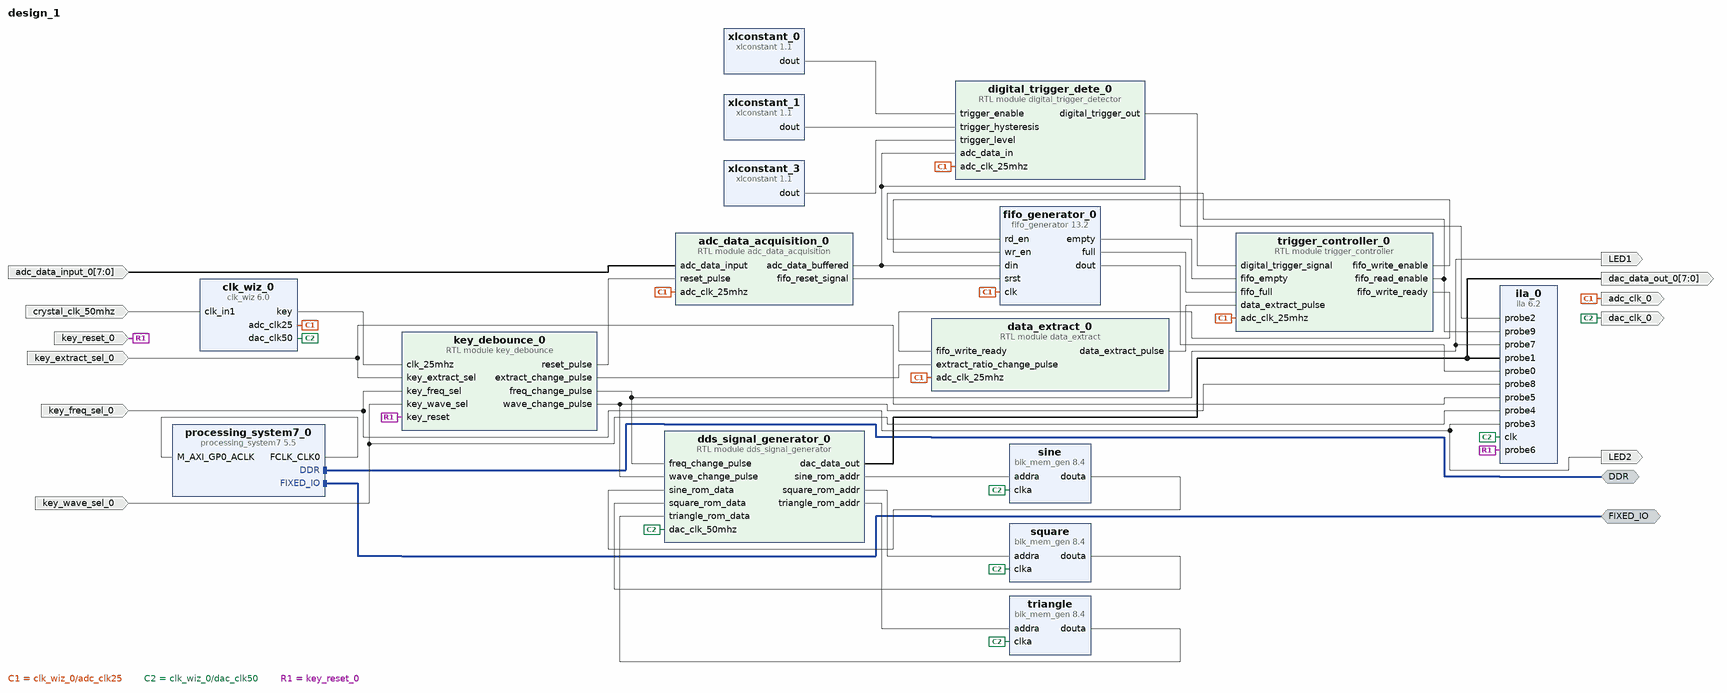
[diagram p0: block diagram of the top level]
# Vivado block design design_1, xc7z010clg400-1, Vivado 2025.1
create_bd_design design_1

create_bd_intf_port -mode Master -vlnv xilinx.com:interface:ddrx_rtl:1.0 DDR
create_bd_intf_port -mode Master -vlnv xilinx.com:display_processing_system7:fixedio_rtl:1.0 FIXED_IO
create_bd_port -dir I -type clk crystal_clk_50mhz
set_property -dict {CONFIG.FREQ_HZ 50000000} [get_bd_ports crystal_clk_50mhz]
create_bd_port -dir I key_freq_sel_0
create_bd_port -dir I key_wave_sel_0
create_bd_port -dir I key_extract_sel_0
create_bd_port -dir I -type rst key_reset_0
create_bd_port -dir O -from 7 -to 0 dac_data_out_0
create_bd_port -dir I -from 7 -to 0 adc_data_input_0
create_bd_port -dir O -type clk adc_clk_0
create_bd_port -dir O -type clk dac_clk_0
create_bd_port -dir O LED1
create_bd_port -dir O LED2

create_bd_cell -type ip -vlnv xilinx.com:ip:processing_system7:5.5 processing_system7_0
set_property -dict [list \
  CONFIG.PCW_ENET0_PERIPHERAL_ENABLE 0 \
  CONFIG.PCW_GPIO_MIO_GPIO_ENABLE 1 \
  CONFIG.PCW_GPIO_MIO_GPIO_IO MIO \
  CONFIG.PCW_I2C_RESET_ENABLE 1 \
  CONFIG.PCW_PRESET_BANK1_VOLTAGE {LVCMOS 1.8V} \
  CONFIG.PCW_QSPI_GRP_SINGLE_SS_ENABLE 1 \
  CONFIG.PCW_QSPI_GRP_SINGLE_SS_IO {MIO 1 .. 6} \
  CONFIG.PCW_QSPI_PERIPHERAL_ENABLE 1 \
  CONFIG.PCW_QSPI_QSPI_IO {MIO 1 .. 6} \
  CONFIG.PCW_SD0_GRP_CD_ENABLE 1 \
  CONFIG.PCW_SD0_GRP_CD_IO {MIO 47} \
  CONFIG.PCW_SD0_GRP_WP_ENABLE 0 \
  CONFIG.PCW_SD0_PERIPHERAL_ENABLE 1 \
  CONFIG.PCW_SD0_SD0_IO {MIO 40 .. 45} \
  CONFIG.PCW_SDIO_PERIPHERAL_FREQMHZ 100 \
  CONFIG.PCW_SINGLE_QSPI_DATA_MODE x4 \
  CONFIG.PCW_UART0_PERIPHERAL_ENABLE 1 \
  CONFIG.PCW_UART0_UART0_IO EMIO \
  CONFIG.PCW_UART1_GRP_FULL_ENABLE 1 \
  CONFIG.PCW_UART1_GRP_FULL_IO EMIO \
  CONFIG.PCW_UART1_PERIPHERAL_ENABLE 1 \
  CONFIG.PCW_UART1_UART1_IO {MIO 48 .. 49} \
  CONFIG.PCW_UART_PERIPHERAL_FREQMHZ 100 \
  CONFIG.PCW_UIPARAM_DDR_PARTNO {MT41J128M16 HA-125} \
  CONFIG.PCW_USB0_PERIPHERAL_ENABLE 1 \
  CONFIG.PCW_USB0_RESET_ENABLE 1 \
  CONFIG.PCW_USB0_RESET_IO {MIO 46} \
  CONFIG.PCW_USB0_USB0_IO {MIO 28 .. 39} \
  CONFIG.PCW_USB_RESET_ENABLE 1 \
  CONFIG.PCW_USB_RESET_SELECT {Share reset pin} \
] [get_bd_cells processing_system7_0]
# 212 more settings of processing_system7_0 are not shown: defaults, MIO pin electricals, DDR timing, and values the tool derives
create_bd_cell -type ip -vlnv xilinx.com:ip:clk_wiz:6.0 clk_wiz_0
set_property -dict [list \
  CONFIG.CLKIN1_JITTER_PS 200.0 \
  CONFIG.CLKOUT1_JITTER 192.113 \
  CONFIG.CLKOUT1_PHASE_ERROR 164.985 \
  CONFIG.CLKOUT1_REQUESTED_OUT_FREQ 50 \
  CONFIG.CLKOUT2_JITTER 236.428 \
  CONFIG.CLKOUT2_PHASE_ERROR 164.985 \
  CONFIG.CLKOUT2_REQUESTED_OUT_FREQ 25 \
  CONFIG.CLKOUT2_USED true \
  CONFIG.CLKOUT3_JITTER 236.428 \
  CONFIG.CLKOUT3_PHASE_ERROR 164.985 \
  CONFIG.CLKOUT3_REQUESTED_OUT_FREQ 25 \
  CONFIG.CLKOUT3_USED true \
  CONFIG.CLKOUT4_JITTER 279.698 \
  CONFIG.CLKOUT4_PHASE_ERROR 150.329 \
  CONFIG.CLKOUT4_REQUESTED_OUT_FREQ 25 \
  CONFIG.CLKOUT4_USED false \
  CONFIG.CLK_OUT1_PORT dac_clk50 \
  CONFIG.CLK_OUT2_PORT adc_clk25 \
  CONFIG.CLK_OUT3_PORT key \
  CONFIG.CLK_OUT4_PORT key \
  CONFIG.MMCM_CLKFBOUT_MULT_F 20.000 \
  CONFIG.MMCM_CLKIN1_PERIOD 20.000 \
  CONFIG.MMCM_CLKIN2_PERIOD 10.0 \
  CONFIG.MMCM_CLKOUT0_DIVIDE_F 20.000 \
  CONFIG.MMCM_CLKOUT1_DIVIDE 40 \
  CONFIG.MMCM_CLKOUT2_DIVIDE 40 \
  CONFIG.MMCM_CLKOUT3_DIVIDE 1 \
  CONFIG.MMCM_DIVCLK_DIVIDE 1 \
  CONFIG.NUM_OUT_CLKS 3 \
  CONFIG.OVERRIDE_MMCM false \
  CONFIG.PRIM_IN_FREQ 50 \
  CONFIG.USE_LOCKED false \
  CONFIG.USE_RESET false \
] [get_bd_cells clk_wiz_0]
create_bd_cell -type module -reference data_extract data_extract_0
create_bd_cell -type module -reference dds_signal_generator dds_signal_generator_0
create_bd_cell -type module -reference digital_trigger_detector digital_trigger_dete_0
create_bd_cell -type module -reference key_debounce key_debounce_0
create_bd_cell -type module -reference trigger_controller trigger_controller_0
create_bd_cell -type module -reference adc_data_acquisition adc_data_acquisition_0
create_bd_cell -type ip -vlnv xilinx.com:ip:blk_mem_gen:8.4 sine
set_property -dict [list \
  CONFIG.Coe_File ../../../../../../wave/sin512.coe \
  CONFIG.Enable_A Always_Enabled \
  CONFIG.Load_Init_File true \
  CONFIG.Memory_Type Single_Port_ROM \
  CONFIG.Write_Depth_A 512 \
  CONFIG.Write_Width_A 8 \
  CONFIG.use_bram_block Stand_Alone \
] [get_bd_cells sine]
create_bd_cell -type ip -vlnv xilinx.com:ip:blk_mem_gen:8.4 square
set_property -dict [list \
  CONFIG.Coe_File ../../../../../../wave/square512.coe \
  CONFIG.Enable_A Always_Enabled \
  CONFIG.Load_Init_File true \
  CONFIG.Memory_Type Single_Port_ROM \
  CONFIG.Write_Depth_A 512 \
  CONFIG.Write_Width_A 8 \
  CONFIG.use_bram_block Stand_Alone \
] [get_bd_cells square]
create_bd_cell -type ip -vlnv xilinx.com:ip:blk_mem_gen:8.4 triangle
set_property -dict [list \
  CONFIG.Coe_File ../../../../../../wave/triangular512.coe \
  CONFIG.Enable_A Always_Enabled \
  CONFIG.Load_Init_File true \
  CONFIG.Memory_Type Single_Port_ROM \
  CONFIG.Write_Depth_A 512 \
  CONFIG.Write_Width_A 8 \
  CONFIG.use_bram_block Stand_Alone \
] [get_bd_cells triangle]
create_bd_cell -type ip -vlnv xilinx.com:ip:fifo_generator:13.2 fifo_generator_0
set_property -dict {CONFIG.Input_Data_Width 8 CONFIG.Input_Depth 16384} [get_bd_cells fifo_generator_0]
create_bd_cell -type ip -vlnv xilinx.com:ip:ila:6.2 ila_0
set_property -dict [list \
  CONFIG.C_DATA_DEPTH 32768 \
  CONFIG.C_MONITOR_TYPE Native \
  CONFIG.C_NUM_OF_PROBES 10 \
  CONFIG.C_PROBE0_WIDTH 8 \
  CONFIG.C_PROBE1_WIDTH 8 \
  CONFIG.C_PROBE2_WIDTH 8 \
] [get_bd_cells ila_0]
create_bd_cell -type ip -vlnv xilinx.com:ip:xlconstant:1.1 xlconstant_3
set_property -dict {CONFIG.CONST_VAL 120 CONFIG.CONST_WIDTH 8} [get_bd_cells xlconstant_3]
create_bd_cell -type ip -vlnv xilinx.com:ip:xlconstant:1.1 xlconstant_1
set_property -dict {CONFIG.CONST_VAL 3 CONFIG.CONST_WIDTH 3} [get_bd_cells xlconstant_1]
create_bd_cell -type ip -vlnv xilinx.com:ip:xlconstant:1.1 xlconstant_0

# ---- connections ----

connect_bd_intf_net [get_bd_intf_ports DDR] [get_bd_intf_pins processing_system7_0/DDR]
connect_bd_intf_net [get_bd_intf_ports FIXED_IO] [get_bd_intf_pins processing_system7_0/FIXED_IO]
connect_bd_net [get_bd_pins adc_data_acquisition_0/adc_data_buffered] \
  [get_bd_pins digital_trigger_dete_0/adc_data_in] [get_bd_pins fifo_generator_0/din] [get_bd_pins ila_0/probe2]
connect_bd_net [get_bd_pins adc_data_acquisition_0/fifo_reset_signal] [get_bd_pins fifo_generator_0/srst]
connect_bd_net -net adc_data_input_0_1 [get_bd_ports adc_data_input_0] [get_bd_pins adc_data_acquisition_0/adc_data_input]
connect_bd_net -net clk_in1_0_1 [get_bd_ports crystal_clk_50mhz] [get_bd_pins clk_wiz_0/clk_in1]
connect_bd_net [get_bd_pins clk_wiz_0/adc_clk25] \
  [get_bd_pins data_extract_0/adc_clk_25mhz] [get_bd_pins digital_trigger_dete_0/adc_clk_25mhz] \
  [get_bd_pins adc_data_acquisition_0/adc_clk_25mhz] [get_bd_pins fifo_generator_0/clk] [get_bd_ports adc_clk_0] \
  [get_bd_pins trigger_controller_0/adc_clk_25mhz]
connect_bd_net [get_bd_pins clk_wiz_0/dac_clk50] \
  [get_bd_ports dac_clk_0] [get_bd_pins sine/clka] [get_bd_pins square/clka] [get_bd_pins triangle/clka] \
  [get_bd_pins ila_0/clk] [get_bd_pins dds_signal_generator_0/dac_clk_50mhz]
connect_bd_net [get_bd_pins clk_wiz_0/key] [get_bd_pins key_debounce_0/clk_25mhz]
connect_bd_net [get_bd_pins data_extract_0/data_extract_pulse] [get_bd_pins trigger_controller_0/data_extract_pulse]
connect_bd_net [get_bd_pins dds_signal_generator_0/dac_data_out] [get_bd_ports dac_data_out_0] [get_bd_pins ila_0/probe1]
connect_bd_net [get_bd_pins dds_signal_generator_0/sine_rom_addr] [get_bd_pins sine/addra]
connect_bd_net [get_bd_pins dds_signal_generator_0/square_rom_addr] [get_bd_pins square/addra]
connect_bd_net [get_bd_pins dds_signal_generator_0/triangle_rom_addr] [get_bd_pins triangle/addra]
connect_bd_net [get_bd_pins digital_trigger_dete_0/digital_trigger_out] [get_bd_pins trigger_controller_0/digital_trigger_signal]
connect_bd_net [get_bd_pins fifo_generator_0/dout] [get_bd_pins ila_0/probe0]
connect_bd_net [get_bd_pins fifo_generator_0/empty] [get_bd_pins trigger_controller_0/fifo_empty]
connect_bd_net [get_bd_pins fifo_generator_0/full] [get_bd_pins trigger_controller_0/fifo_full]
connect_bd_net [get_bd_pins key_debounce_0/extract_change_pulse] [get_bd_pins data_extract_0/extract_ratio_change_pulse]
connect_bd_net [get_bd_pins key_debounce_0/freq_change_pulse] \
  [get_bd_pins ila_0/probe7] [get_bd_ports LED1] [get_bd_pins dds_signal_generator_0/freq_change_pulse]
connect_bd_net [get_bd_pins key_debounce_0/reset_pulse] [get_bd_pins adc_data_acquisition_0/reset_pulse]
connect_bd_net [get_bd_pins key_debounce_0/wave_change_pulse] [get_bd_pins ila_0/probe8] [get_bd_pins dds_signal_generator_0/wave_change_pulse]
connect_bd_net -net key_extract_sel_0_1 [get_bd_ports key_extract_sel_0] [get_bd_pins ila_0/probe5] [get_bd_pins key_debounce_0/key_extract_sel]
connect_bd_net -net key_freq_sel_0_1 [get_bd_ports key_freq_sel_0] \
  [get_bd_pins ila_0/probe3] [get_bd_ports LED2] [get_bd_pins key_debounce_0/key_freq_sel]
connect_bd_net -net key_reset_0_1 [get_bd_ports key_reset_0] [get_bd_pins ila_0/probe6] [get_bd_pins key_debounce_0/key_reset]
connect_bd_net -net key_wave_sel_0_1 [get_bd_ports key_wave_sel_0] [get_bd_pins ila_0/probe4] [get_bd_pins key_debounce_0/key_wave_sel]
connect_bd_net [get_bd_pins processing_system7_0/FCLK_CLK0] [get_bd_pins processing_system7_0/M_AXI_GP0_ACLK]
connect_bd_net -net sin_douta [get_bd_pins sine/douta] [get_bd_pins dds_signal_generator_0/sine_rom_data]
connect_bd_net [get_bd_pins square/douta] [get_bd_pins dds_signal_generator_0/square_rom_data]
connect_bd_net [get_bd_pins triangle/douta] [get_bd_pins dds_signal_generator_0/triangle_rom_data]
connect_bd_net [get_bd_pins trigger_controller_0/fifo_read_enable] [get_bd_pins fifo_generator_0/rd_en] [get_bd_pins ila_0/probe9]
connect_bd_net [get_bd_pins trigger_controller_0/fifo_write_enable] [get_bd_pins fifo_generator_0/wr_en]
connect_bd_net [get_bd_pins trigger_controller_0/fifo_write_ready] [get_bd_pins data_extract_0/fifo_write_ready]
connect_bd_net [get_bd_pins xlconstant_0/dout] [get_bd_pins digital_trigger_dete_0/trigger_enable]
connect_bd_net [get_bd_pins xlconstant_1/dout] [get_bd_pins digital_trigger_dete_0/trigger_hysteresis]
connect_bd_net [get_bd_pins xlconstant_3/dout] [get_bd_pins digital_trigger_dete_0/trigger_level]

validate_bd_design
save_bd_design
